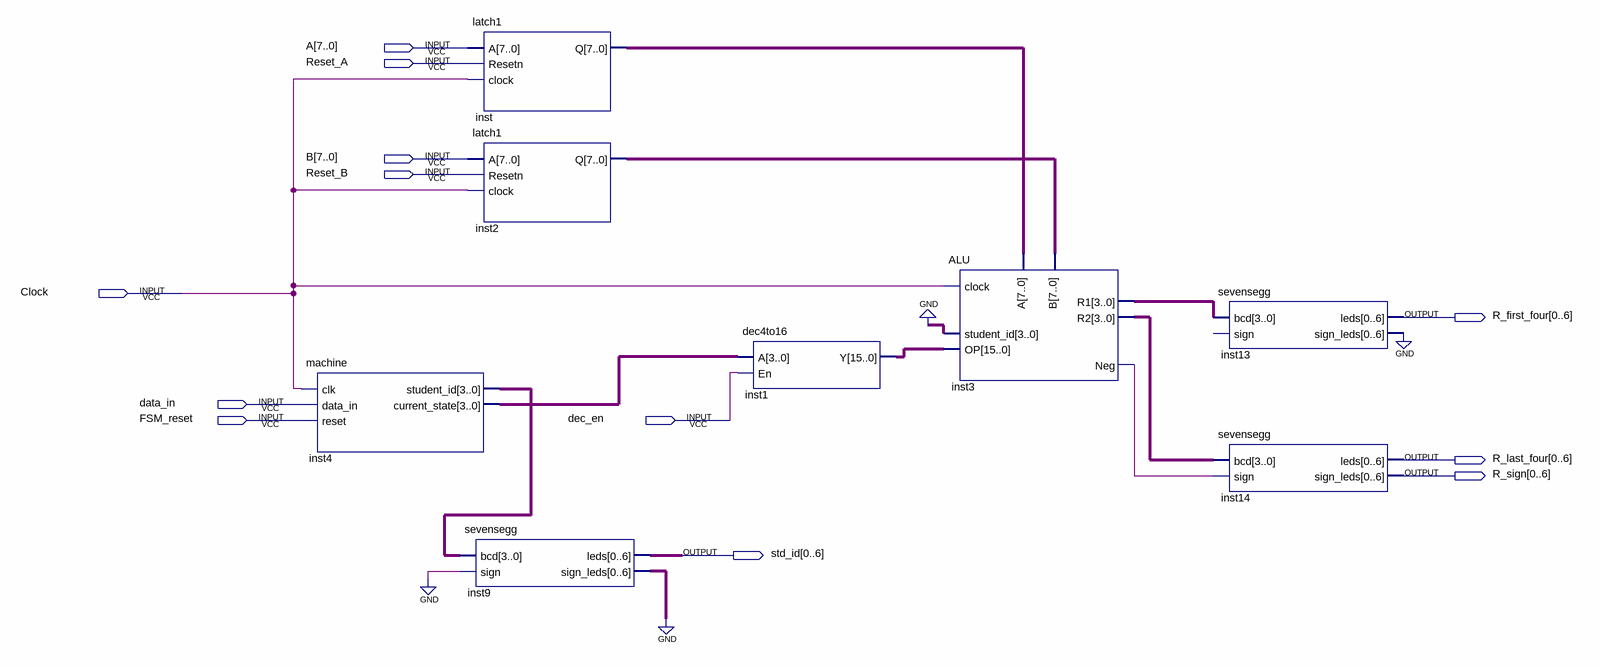
[diagram p0: schematic sheet]
// Quartus schematic finalproject.bdf as structural Verilog: 8 symbols, 12 pins
module finalproject (
  input  [7:0] A,
  input  Reset_A,
  input  [7:0] B,
  input  Reset_B,
  input  Clock,
  input  data_in,
  input  FSM_reset,
  input  dec_en,
  output [0:6] R_first_four,
  output [0:6] R_last_four,
  output [0:6] R_sign,
  output [0:6] std_id
);

  wire inst3_neg;
  wire [3:0] inst3_r1, inst3_r2, inst4_current_state, inst4_student_id;
  wire [6:0] inst9_sign_leds, inst13_sign_leds;
  wire [7:0] inst2_q, inst_q;
  wire [15:0] inst1_y;

  machine inst4 (
    .clk(Clock), .data_in(data_in), .reset(FSM_reset), .student_id(inst4_student_id),
    .current_state(inst4_current_state));
  latch1 inst (.A(A), .Resetn(Reset_A), .clock(Clock), .Q(inst_q));
  latch1 inst2 (.A(B), .Resetn(Reset_B), .clock(Clock), .Q(inst2_q));
  sevensegg inst9 (.bcd(inst4_student_id), .sign(1'b0), .leds(std_id), .sign_leds(inst9_sign_leds));
  dec4to16 inst1 (.A(inst4_current_state), .En(dec_en), .Y(inst1_y));
  ALU inst3 (
    .clock(Clock), .A(inst_q), .B(inst2_q), .student_id(4'b0000), .OP(inst1_y), .Neg(inst3_neg),
    .R1(inst3_r1), .R2(inst3_r2));
  sevensegg inst13 (.bcd(inst3_r1), .leds(R_first_four), .sign_leds(inst13_sign_leds));  // open: sign
  sevensegg inst14 (.bcd(inst3_r2), .sign(inst3_neg), .leds(R_last_four), .sign_leds(R_sign));
  // also tied to GND on the sheet: {inst9_sign_leds[0], inst9_sign_leds[1], inst9_sign_leds[2], inst9_sign_leds[3], inst9_sign_leds[4], inst9_sign_leds[5], inst9_sign_leds[6], inst13_sign_leds[0], inst13_sign_leds[1], inst13_sign_leds[2], inst13_sign_leds[3], inst13_sign_leds[4], inst13_sign_leds[5], inst13_sign_leds[6]}
endmodule
